# EAGLE board csa_gecko_v3.0d (EAGLE 4.16), part 1 of 2
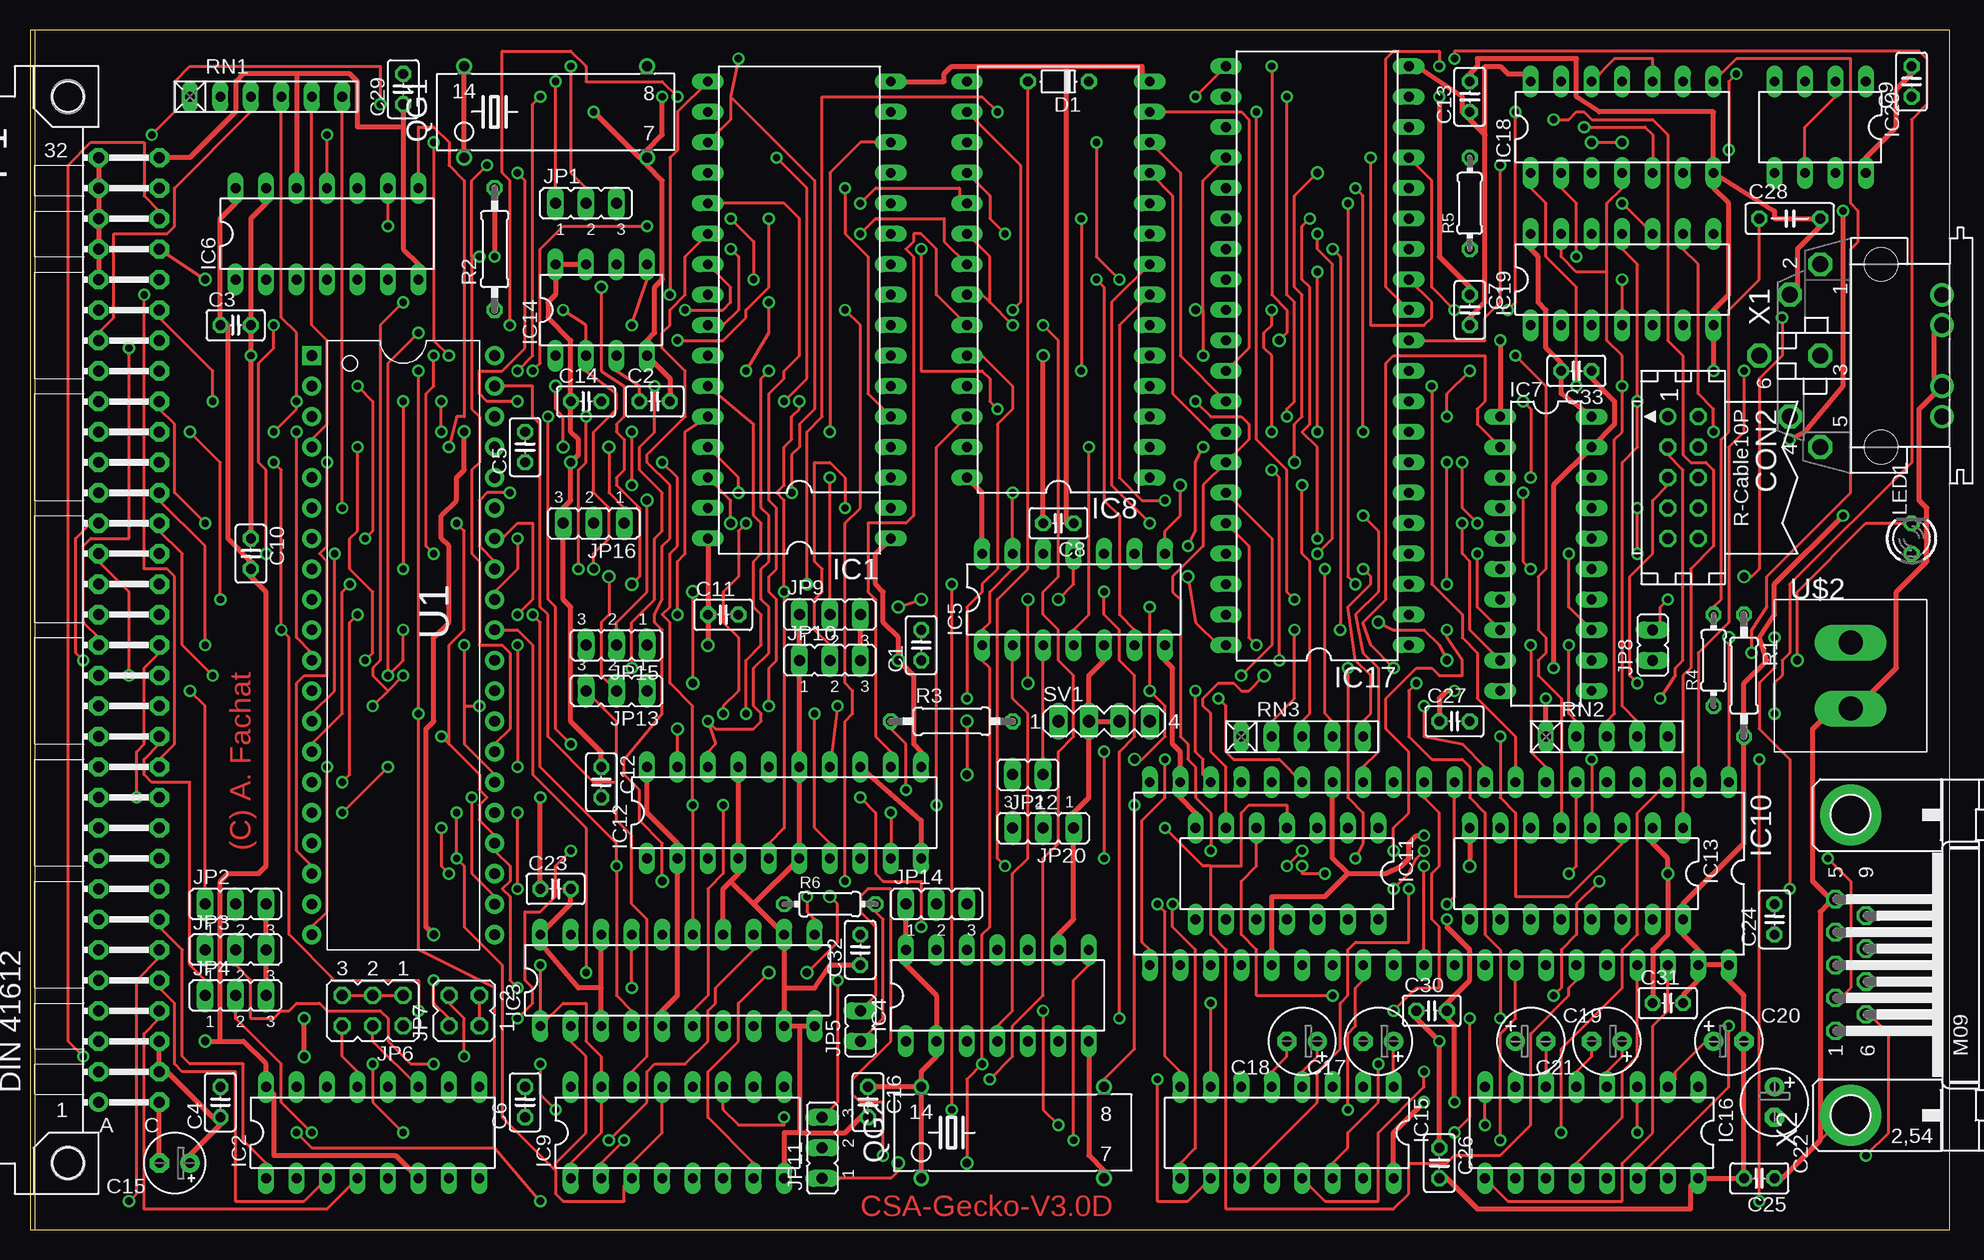
[diagram p2: board, top side]
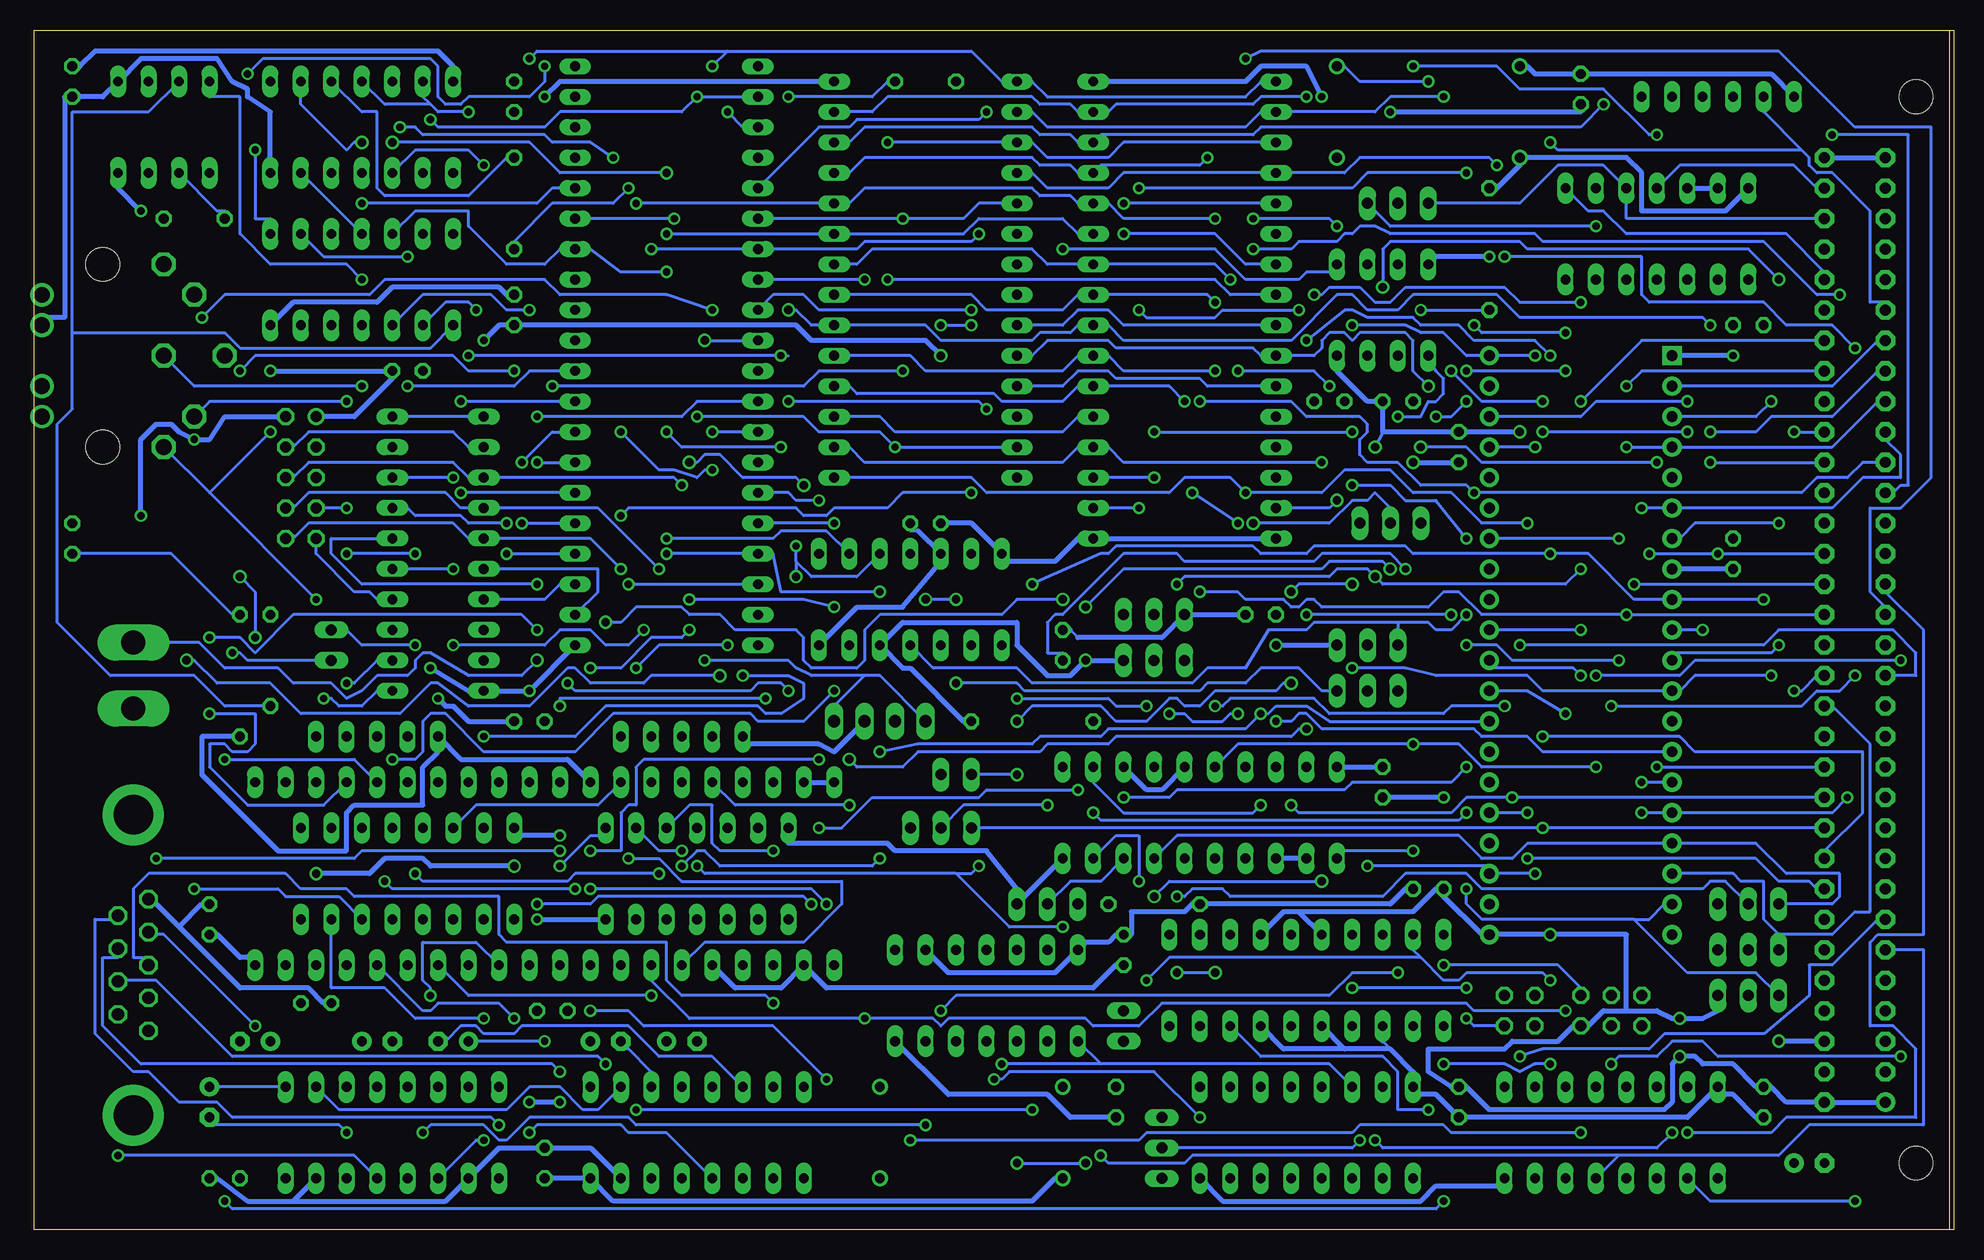
[diagram p3: board, bottom side, seen from below]

Size 160 x 100.03 mm. Coordinates in mm from the lower left corner, seen from the top.
Outline: 0,0.01 160,0.01 160,100.01 0,100.01 0,0.01
Copper layers (1*16): Top 0.035mm / dielectric 1.5mm / Bottom 0.035mm
Design rules "default": minimum track width 10mil, minimum drill 24mil, track to track 8mil, track to pad 8mil, pad to pad 8mil, via to via 8mil, smd to smd 8mil, copper to edge 40mil, drill to drill 8mil, minimum pad ring 10mil, minimum via ring 8mil, stop-mask expansion 4mil, vias tented up to drill 0mil, thermal gap 10mil

## Footprints (pad centres in the part's own frame; a part is rotated, then mirrored left to right if it is on the bottom)
C025-025X050 = drill 0.813 octagon: 1 -1.27,0; 2 1.27,0
E2,5-5 = drill 0.813 pad 1.6 round: + -1.27,0 | drill 0.813 pad 1.6 octagon: - 1.27,0
E2,5-6 = drill 0.813 pad 1.6 round: + -1.27,0 | drill 0.813 pad 1.6 octagon: - 1.27,0
C050-025X075 = drill 0.813 octagon: 1 -2.54,0; 2 2.54,0
CON10 = drill 0.914 round: 1 -5.08,-1.27 | drill 0.914 octagon: 2 -5.08,1.27; 3 -2.54,-1.27; 4 -2.54,1.27; 5 0,-1.27; 6 0,1.27; 7 2.54,-1.27; 8 2.54,1.27; 9 5.08,-1.27; 10 5.08,1.27
D-5 = drill 0.813 octagon: A 2.54,0; C -2.54,0
DIL32OPT28 = drill 0.813 long: 1 -19.05,-7.62; 2 -16.51,-7.62; 3 -13.97,-7.62; 4 -11.43,-7.62; 5 -8.89,-7.62; 6 -6.35,-7.62; 7 -3.81,-7.62; 8 -1.27,-7.62; 9 1.27,-7.62; 10 3.81,-7.62; 11 6.35,-7.62; 12 8.89,-7.62; 13 11.43,-7.62; 14 13.97,-7.62; 15 16.51,-7.62; 16 19.05,-7.62; 17 19.05,7.62; 18 16.51,7.62; 19 13.97,7.62; 20 11.43,7.62; 21 8.89,7.62; 22 6.35,7.62; 23 3.81,7.62; 24 1.27,7.62; 25 -1.27,7.62; 26 -3.81,7.62; 27 -6.35,7.62; 28 -8.89,7.62; 29 -11.43,7.62; 30 -13.97,7.62; 31 -16.51,7.62; 32 -19.05,7.62
DIL16 = drill 0.813 long: 1 -8.89,-3.81; 2 -6.35,-3.81; 3 -3.81,-3.81; 4 -1.27,-3.81; 5 1.27,-3.81; 6 3.81,-3.81; 7 6.35,-3.81; 8 8.89,-3.81; 9 8.89,3.81; 10 6.35,3.81; 11 3.81,3.81; 12 1.27,3.81; 13 -1.27,3.81; 14 -3.81,3.81; 15 -6.35,3.81; 16 -8.89,3.81
DIL20 = drill 0.813 long: 1 -10.16,-3.81; 2 -7.62,-3.81; 3 -5.08,-3.81; 4 -2.54,-3.81; 5 0,-3.81; 6 2.54,-3.81; 7 5.08,-3.81; 8 7.62,-3.81; 9 10.16,-3.81; 10 12.7,-3.81; 11 12.7,3.81; 12 10.16,3.81; 13 7.62,3.81; 14 5.08,3.81; 15 2.54,3.81; 16 0,3.81; 17 -2.54,3.81; 18 -5.08,3.81; 19 -7.62,3.81; 20 -10.16,3.81
DIL14 = drill 0.813 long: 1 -7.62,-3.81; 2 -5.08,-3.81; 3 -2.54,-3.81; 4 0,-3.81; 5 2.54,-3.81; 6 5.08,-3.81; 7 7.62,-3.81; 8 7.62,3.81; 9 5.08,3.81; 10 2.54,3.81; 11 0,3.81; 12 -2.54,3.81; 13 -5.08,3.81; 14 -7.62,3.81
DIL20' = drill 0.813 long: 1 -11.43,-3.81; 2 -8.89,-3.81; 3 -6.35,-3.81; 4 -3.81,-3.81; 5 -1.27,-3.81; 6 1.27,-3.81; 7 3.81,-3.81; 8 6.35,-3.81; 9 8.89,-3.81; 10 11.43,-3.81; 11 11.43,3.81; 12 8.89,3.81; 13 6.35,3.81; 14 3.81,3.81; 15 1.27,3.81; 16 -1.27,3.81; 17 -3.81,3.81; 18 -6.35,3.81; 19 -8.89,3.81; 20 -11.43,3.81
DIL28 = drill 0.813 long: 1 -13.97,-7.62; 2 -11.43,-7.62; 3 -8.89,-7.62; 4 -6.35,-7.62; 5 -3.81,-7.62; 6 -1.27,-7.62; 7 1.27,-7.62; 8 3.81,-7.62; 9 6.35,-7.62; 10 8.89,-7.62; 11 11.43,-7.62; 12 13.97,-7.62; 13 16.51,-7.62; 14 19.05,-7.62; 15 19.05,7.62; 16 16.51,7.62; 17 13.97,7.62; 18 11.43,7.62; 19 8.89,7.62; 20 6.35,7.62; 21 3.81,7.62; 22 1.27,7.62; 23 -1.27,7.62; 24 -3.81,7.62; 25 -6.35,7.62; 26 -8.89,7.62; 27 -11.43,7.62; 28 -13.97,7.62
DIL40 = drill 0.813 long: 1 -16.51,-7.62; 2 -13.97,-7.62; 3 -11.43,-7.62; 4 -8.89,-7.62; 5 -6.35,-7.62; 6 -3.81,-7.62; 7 -1.27,-7.62; 8 1.27,-7.62; 9 3.81,-7.62; 10 6.35,-7.62; 11 8.89,-7.62; 12 11.43,-7.62; 13 13.97,-7.62; 14 16.51,-7.62; 15 19.05,-7.62; 16 21.59,-7.62; 17 24.13,-7.62; 18 26.67,-7.62; 19 29.21,-7.62; 20 31.75,-7.62; 21 31.75,7.62; 22 29.21,7.62; 23 26.67,7.62; 24 24.13,7.62; 25 21.59,7.62; 26 19.05,7.62; 27 16.51,7.62; 28 13.97,7.62; 29 11.43,7.62; 30 8.89,7.62; 31 6.35,7.62; 32 3.81,7.62; 33 1.27,7.62; 34 -1.27,7.62; 35 -3.81,7.62; 36 -6.35,7.62; 37 -8.89,7.62; 38 -11.43,7.62; 39 -13.97,7.62; 40 -16.51,7.62
DIL08 = drill 0.813 long: 1 -11.43,-2.54; 2 -8.89,-2.54; 3 -6.35,-2.54; 4 -3.81,-2.54; 5 -3.81,5.08; 6 -6.35,5.08; 7 -8.89,5.08; 8 -11.43,5.08
DIL08' = drill 0.813 long: 1 -3.81,-3.81; 2 -1.27,-3.81; 3 1.27,-3.81; 4 3.81,-3.81; 5 3.81,3.81; 6 1.27,3.81; 7 -1.27,3.81; 8 -3.81,3.81
JP2 = drill 0.914 long: 1 -2.54,0; 2 0,0; 3 2.54,0
JP1 = drill 0.914 long: 1 0,-1.27; 2 0,1.27
JP3Q = drill 0.914 octagon: 1 -2.54,-1.27; 2 -2.54,1.27; 3 0,-1.27; 4 0,1.27; 5 2.54,-1.27; 6 2.54,1.27
JP2Q = drill 0.914 octagon: 1 -1.27,-1.27; 2 -1.27,1.27; 3 1.27,-1.27; 4 1.27,1.27
LED3MM = drill 0.813 octagon: A -1.27,0; K 1.27,0
CSABUS = drill 0.914 pad 1.6 round: A1 7.62,36.83 | drill 0.914 pad 1.6 octagon: A2 7.62,34.29; A3 7.62,31.75; A4 7.62,29.21; A5 7.62,26.67; A6 7.62,24.13; A7 7.62,21.59; A8 7.62,19.05; A9 7.62,16.51; A10 7.62,13.97; A11 7.62,11.43; A12 7.62,8.89; A13 7.62,6.35; A14 7.62,3.81; A15 7.62,1.27; A16 7.62,-1.27; A17 7.62,-3.81; A18 7.62,-6.35; A19 7.62,-8.89; A20 7.62,-11.43; A21 7.62,-13.97; A22 7.62,-16.51; A23 7.62,-19.05; A24 7.62,-21.59; A25 7.62,-24.13; A26 7.62,-26.67; A27 7.62,-29.21; A28 7.62,-31.75; A29 7.62,-34.29; A30 7.62,-36.83; A31 7.62,-39.37; A32 7.62,-41.91; C1 2.54,36.83; C2 2.54,34.29; C3 2.54,31.75; C4 2.54,29.21; C5 2.54,26.67; C6 2.54,24.13; C7 2.54,21.59; C8 2.54,19.05; C9 2.54,16.51; C10 2.54,13.97; C11 2.54,11.43; C12 2.54,8.89; C13 2.54,6.35; C14 2.54,3.81; C15 2.54,1.27; C16 2.54,-1.27; C17 2.54,-3.81; C18 2.54,-6.35; C19 2.54,-8.89; C20 2.54,-11.43; C21 2.54,-13.97; C22 2.54,-16.51; C23 2.54,-19.05; C24 2.54,-21.59; C25 2.54,-24.13; C26 2.54,-26.67; C27 2.54,-29.21; C28 2.54,-31.75; C29 2.54,-34.29; C30 2.54,-36.83; C31 2.54,-39.37; C32 2.54,-41.91 | hole 2.794: 10.16,41.91; 10.16,-46.99
SG51 = drill 0.813 round: 1 -7.62,-3.81; 7 7.62,-3.81; 8 7.62,3.81; 14 -7.62,3.81
0207/10 = drill 0.813 octagon: 1 -5.08,0; 2 5.08,0
0204/7 = drill 0.813 octagon: 1 -3.81,0; 2 3.81,0
RN-6 = drill 0.813 long: 1 -6.35,0; 2 -3.81,0; 3 -1.27,0; 4 1.27,0; 5 3.81,0; 6 6.35,0
RN-5 = drill 0.813 long: 1 -5.08,0; 2 -2.54,0; 3 0,0; 4 2.54,0; 5 5.08,0
MA04-1 = drill 1.016 long: 1 -3.81,0; 2 -1.27,0; 3 1.27,0; 4 3.81,0
DIP-40 = drill 0.889 pad 1.6 square: 1 -22.86,-7.62 | drill 0.889 pad 1.6 round: 2 -20.32,-7.62; 3 -17.78,-7.62; 4 -15.24,-7.62; 5 -12.7,-7.62; 6 -10.16,-7.62; 7 -7.62,-7.62; 8 -5.08,-7.62; 9 -2.54,-7.62; 10 0,-7.62; 11 2.54,-7.62; 12 5.08,-7.62; 13 7.62,-7.62; 14 10.16,-7.62; 15 12.7,-7.62; 16 15.24,-7.62; 17 17.78,-7.62; 18 20.32,-7.62; 19 22.86,-7.62; 20 25.4,-7.62; 21 25.4,7.62; 22 22.86,7.62; 23 20.32,7.62; 24 17.78,7.62; 25 15.24,7.62; 26 12.7,7.62; 27 10.16,7.62; 28 7.62,7.62; 29 5.08,7.62; 30 2.54,7.62; 31 0,7.62; 32 -2.54,7.62; 33 -5.08,7.62; 34 -7.62,7.62; 35 -10.16,7.62; 36 -12.7,7.62; 37 -15.24,7.62; 38 -17.78,7.62; 39 -20.32,7.62; 40 -22.86,7.62
TASTER = drill 2.007 long: 1 0,4.013; 3 0,-1.473
MAB6H = drill 1.321 octagon: 1 7.62,5.08; 2 5.08,7.62; 3 0,5.08; 4 -5.08,7.62; 5 -7.62,5.08; 6 0,10.16 | drill 1.321 round: PE -2.54,-5.08; PE@ 2.54,-5.08 | hole 2.794: 7.62,0; -7.62,0
M09HP = drill 1.016 octagon: 1 -5.486,1.27; 2 -2.743,1.27; 3 0,1.27; 4 2.743,1.27; 5 5.486,1.27; 6 -4.115,-1.27; 7 -1.372,-1.27; 8 1.372,-1.27; 9 4.115,-1.27 | drill 3.302 pad 5.08 round: G1 -12.522,0; G2 12.522,0

## Placement (x,y rotation side)
C1  100n  [C025-025X050]  74.29,48.74 90 top
C2  100n  [C025-025X050]  52.07,69.06 0 top
C3  100n  [C025-025X050]  17.14,75.41 0 top
C4  100n  [C025-025X050]  15.87,10.64 90 top
C5  100n  [C025-025X050]  41.27,65.25 90 top
C6  100n  [C025-025X050]  41.27,10.64 90 top
C7  100n  [C025-025X050]  120.01,76.68 270 top
C8  100n  [C025-025X050]  85.72,58.9 180 top
C9  100n  [C025-025X050]  156.84,95.73 90 top
C10  100n  [C025-025X050]  18.41,56.36 270 top
C11  100n  [C025-025X050]  57.78,51.28 0 top
C12  100n  [C025-025X050]  47.62,37.31 270 top
C13  100n  [C025-025X050]  120.01,94.46 90 top
C14  100n  [C025-025X050]  46.35,69.06 0 top
C15  47u  [E2,5-5]  12.06,5.56 180 top
C16  100n  [C025-025X050]  69.84,10.64 270 top
C17  1u  [E2,5-6]  112.39,15.72 180 top
C18  1u  [E2,5-6]  106.04,15.72 180 top
C19  4u7  [E2,5-6]  125.09,15.72 0 top
C20  4u7  [E2,5-6]  141.6,15.72 0 top
C21  1u  [E2,5-6]  131.44,15.72 180 top
C22  1u  [E2,5-6]  145.41,10.64 270 top
C23  100n  [C025-025X050]  43.81,28.42 0 top
C24  100n  [C025-025X050]  145.41,25.88 90 top
C25  100n  [C025-025X050]  144.14,4.29 180 top
C26  100n  [C025-025X050]  117.47,5.56 270 top
C27  100n  [C025-025X050]  118.74,42.39 0 top
C28  390p  [C050-025X075]  146.68,84.3 0 top
C29  100n  [C025-025X050]  31.11,95.1 90 top
C30  100n  [C025-025X050]  116.83,18.26 0 top
C31  100n  [C025-025X050]  136.52,18.9 0 top
C32  100n  [C025-025X050]  69.21,23.34 90 top
C33  100n  [C025-025X050]  128.9,71.6 180 top
CON2  [CON10]  137.79,62.71 270 top
D1  [D-5]  85.72,95.73 180 top
IC1  ROMSOCK32TO512K  [DIL32OPT28]  64.13,76.68 90 top
IC2  74LS138N  [DIL16]  28.57,8.1 0 top
IC3  74LS688BUSOPT  [DIL20]  52.7,20.8 0 top
IC4  74LS164N  [DIL14]  80.64,19.53 0 top
IC5  74LS86N  [DIL14]  86.99,52.55 0 top
IC6  74LS293N  [DIL14]  24.76,83.03 0 top
IC7  74LS245N  [DIL20']  126.36,56.36 270 top
IC8  RAMSOCKET8OR32K  [DIL28]  85.72,76.68 90 top
IC9  74LS139N  [DIL16]  53.97,8.1 0 top
IC10  UART  [DIL40]  125.09,29.69 180 top
IC11  74LS06N  [DIL14]  104.77,29.69 180 top
IC12  74LS688BUSOPT  [DIL20]  61.59,34.77 0 top
IC13  74LS138N  [DIL16]  128.9,29.69 180 top
IC14  TL7705  [DIL08]  55.24,75.41 0 top
IC15  MAX232  [DIL16]  104.77,8.1 180 top
IC16  MAX232  [DIL16]  130.17,8.1 180 top
IC17  VIA  [DIL40]  107.31,65.25 90 top
IC18  74LS06N  [DIL14]  132.71,91.92 0 top
IC19  74LS14N  [DIL14]  132.71,79.22 0 top
IC20  LMC555N  [DIL08']  149.22,91.92 180 top
JP1  [JP2]  46.35,85.57 0 top
JP2  [JP2]  17.14,27.15 0 top
JP3  [JP2]  17.14,23.34 0 top
JP4  [JP2]  17.14,19.53 0 top
JP5  [JP1]  69.21,16.99 0 top
JP6  [JP3Q]  28.57,18.26 180 top
JP7  [JP2Q]  36.19,18.26 90 top
JP8  [JP1]  135.25,48.74 0 top
JP9  [JP2]  66.67,51.28 0 top
JP10  [JP2]  66.67,47.47 0 top
JP11  [JP2]  66.03,6.83 90 top
JP12  [JP1]  83.18,37.95 90 top
JP13  [JP2]  48.89,44.93 180 top
JP14  [JP2]  75.56,27.15 0 top
JP15  [JP2]  48.89,48.74 180 top
JP16  [JP2]  46.98,58.9 180 top
JP20  [JP2]  84.45,33.5 180 top
LED1  [LED3MM]  156.84,57.63 90 top
P1  CSABUS  [CSABUS]  13.33,47.47 180 top
QG1  16MHz  [SG51]  43.81,93.19 0 top
QG2  1,8432MHz  [SG51]  81.91,8.1 0 top
R1  240  [0207/10]  142.87,46.2 270 top
R2  10k  [0207/10]  38.73,81.76 90 top
R3  10k  [0207/10]  76.83,42.39 0 top
R4  47k  [0204/7]  140.33,47.47 90 top
R5  33  [0204/7]  120.01,85.57 90 top
R6  33  [0204/7]  66.67,27.15 0 top
RN1  10k  [RN-6]  19.68,94.46 0 top
RN2  [RN-5]  131.44,41.12 0 top
RN3  [RN-5]  106.04,41.12 0 top
SV1  [MA04-1]  89.53,42.39 0 top
U1  [DIP-40]  31.11,50.01 270 top
U$2  TASTER  [TASTER]  151.76,44.93 0 top
X1  MAB6H  [MAB6H]  154.3,72.87 90 top
X2  [M09HP]  151.76,22.07 90 top

## Tracks (layer width: path | path; a pad name or v marks a point on that pad's centre or on a via)
2PHI2  (via drill 0.7)
  Top 0.254: P1.C29 v14.6,79.22 | v47.62,78.59 47.62,71.6 49.53,70.33 49.53,67.79 48.89,67.16 48.89,66.52 49.53,65.89 49.53,63.35 48.89,62.71 48.89,62.08 50.8,60.17 50.8,54.46 v50.16,53.82 | v78.1,42.39 v78.1,37.95 | v55.24,53.19 v55.24,45.57
  Bottom 0.254: v14.6,79.22 17.14,81.76 35.55,81.76 36.19,82.4 46.98,82.4 47.62,81.76 v47.62,78.59 | v78.1,42.39 76.83,43.66 71.11,43.66 69.84,42.39 67.3,42.39 65.4,44.3 64.77,44.3 64.13,43.66 62.86,43.66 61.59,44.93 56.51,44.93 55.88,45.57 v55.24,45.57 | v78.1,37.95 JP12.2 | v50.16,53.82 54.61,53.82 v55.24,53.19
8PHI2  (via drill 0.61)
  Top 0.254: v45.08,97 45.08,88.11 46.35,86.84 JP1.2 | IC6.11 v24.76,91.29
  Bottom 0.254: IC6.11 22.86,88.75 13.33,88.75 11.43,86.84 P1.C31 | v45.08,97 38.1,97 36.19,95.1 29.2,95.1 25.39,91.29 v24.76,91.29
16MHZ  (via drill 0.61)
  Top 0.254: JP1.1 v43.81,95.73 | v86.99,7.47 86.99,20.8 88.26,22.07 IC4.8 | v31.11,8.1 28.57,10.64 v28.57,13.82 | v4.44,14.45 3.17,15.72 3.17,88.75 5.08,90.65 9.52,90.65 9.52,86.21 10.79,84.94 P1.C30
  Bottom 0.254: v43.81,95.73 49.53,95.73 50.8,97 QG1.8 | v86.99,7.47 67.94,7.47 67.3,8.1 50.16,8.1 49.53,8.74 42.54,8.74 41.91,8.1 v31.11,8.1 | v28.57,13.82 27.93,14.45 24.76,14.45 23.49,15.72 20.95,15.72 19.68,14.45 v4.44,14.45 | P1.C30 27.3,84.3 IC6.10 29.2,88.75 33.02,88.75 36.19,85.57 JP1.1
/ATNAOUT  (via drill 0.7)
  Top 0.254: IC5.8 94.61,58.27 95.88,59.54 v95.88,62.08 | v105.41,63.98 105.41,67.16 106.04,67.79 106.04,77.95 105.41,78.59 105.41,86.21 v107.31,88.11 | v130.17,90.65 v132.71,90.65
  Bottom 0.254: v95.88,62.08 96.52,62.71 100.96,62.71 102.86,64.62 104.13,64.62 104.77,63.98 v105.41,63.98 | v107.31,88.11 116.2,88.11 118.74,90.65 v130.17,90.65 | IC18.9 137.79,93.83 133.98,90.02 133.34,90.65 v132.71,90.65
/ATNIN  (via drill 0.61, 0.7)
  Top 0.254: v96.52,57 97.15,58.27 97.15,63.98 v97.78,65.25 | v107.31,66.52 v107.31,79.86 | IC17.40 99.05,48.74 97.15,50.65 v96.52,54.46
  Bottom 0.254: IC19.12 128.27,84.94 123.82,84.94 123.82,83.67 120.64,80.49 117.47,80.49 116.2,81.76 IC17.14 113.66,81.76 111.12,79.86 v107.31,79.86 | 96.52,55.73 95.24,54.46 91.44,54.46 IC5.10 | 96.52,55.73 v96.52,57 | v107.31,66.52 106.04,65.25 v97.78,65.25 | 96.52,55.73 v96.52,54.46
/ATNOUT  (via drill 0.61)
  Top 0.254: v122.55,88.75 122.55,77.32 121.28,76.05 121.28,74.14 IC17.11
  Bottom 0.254: v122.55,88.75 123.82,90.02 128.27,90.02 IC18.3
/BSEL  (via drill 0.61)
  Top 0.254: JP6.5 JP6.3 JP6.1 | IC9.1 45.08,5.56 47.62,8.1 IC9.15 47.62,14.45 46.35,15.72 46.35,18.9 44.45,18.9 IC3.1 v42.54,22.07
  Bottom 0.254: v42.54,22.07 33.02,22.07 31.11,20.17 JP6.1
/CLKIN  (via drill 0.61)
  Top 0.254: v132.71,85.57 IC19.10
  Bottom 0.254: v132.71,85.57 118.1,85.57 116.83,86.84 IC17.16
/CLKOUT  (via drill 0.61)
  Top 0.254: v111.75,89.38 111.75,75.41 116.2,75.41 116.83,76.05 116.83,77.32 IC17.13 | v129.53,91.92 134.62,91.92 135.25,91.29 IC18.5
  Bottom 0.254: v111.75,89.38 113.66,90.65 116.83,90.65 117.47,91.29 127.63,91.29 128.27,91.92 v129.53,91.92
/DATAIN  (via drill 0.61)
  Top 0.254: v117.47,97 117.47,98.27 113.66,98.27 113.02,97.64 113.02,78.59 IC17.12 | v142.23,96.37 141.6,95.73 v141.6,90.02
  Bottom 0.254: v117.47,97 117.47,95.73 118.74,94.46 123.82,94.46 124.45,93.83 125.72,93.83 126.36,94.46 126.36,97 126.99,97.64 140.97,97.64 v142.23,96.37 | v141.6,90.02 141.6,84.3 140.33,84.3 IC19.8
/DATAOUT  (via drill 0.61)
  Top 0.254: v128.9,70.33 128.9,78.59 126.36,81.13 126.36,85.57 125.09,86.84 IC18.1
  Bottom 0.254: v128.9,70.33 120.01,70.33 118.74,71.6 IC17.10
/IOSEL  (via drill 0.61)
  Top 0.254: v36.19,14.45 36.19,17.63 34.92,18.9 JP7.4
  Bottom 0.254: v36.19,14.45 34.29,15.09 25.39,15.09 24.12,16.36 15.87,16.36 12.06,19.53 12.06,22.07 10.16,22.07 6.34,25.88 P1.A7
/IRQ  (via drill 0.61)
  Top 0.254: RN1.5 23.49,75.41 24.76,74.14 24.76,67.16 23.49,65.89 U1.4 | v104.77,30.33 v106.04,31.6 | v81.27,30.33 80.64,30.96 80.64,52.55 83.18,55.09 D1.A | v27.3,65.25 27.3,58.27 26.66,57.63 26.66,55.09 28.57,53.19 28.57,48.11 v27.93,47.47 | v40.64,48.74 v40.64,38.58 | v69.21,36.04 70.48,34.77 70.48,29.69 71.11,29.06 74.29,29.06 v74.29,25.25
  Bottom 0.254: P1.A24 6.34,69.06 10.16,65.25 U1.4 v27.3,65.25 | v106.04,31.6 107.94,31.6 IC11.2 | v104.77,30.33 104.13,29.69 83.18,29.69 | 83.18,29.69 81.91,29.69 v81.27,30.33 | v27.93,47.47 36.83,47.47 38.1,48.74 v40.64,48.74 | v40.64,38.58 41.91,37.31 50.16,37.31 50.8,36.68 64.77,36.68 65.4,36.04 v69.21,36.04 | v74.29,25.25 78.73,25.25 83.18,29.69
/ISIO  (via drill 0.61)
  Top 0.254: v45.08,31.6 43.81,30.33 43.81,27.79 42.54,26.52 41.27,26.52 41.27,20.8 41.91,20.17 41.91,18.9 v40.64,17.63 | JP7.1 JP7.3
  Bottom 0.254: v45.08,31.6 50.8,31.6 IC12.1 | v40.64,17.63 40,16.99 JP7.1
/LOCALIO  (via drill 0.61, 0.7)
  Top 0.254: v102.23,93.19 102.23,65.89 104.77,63.35 104.77,53.19 v105.41,52.55 | v93.34,51.92 v93.34,44.93 94.61,43.66 94.61,41.12 92.7,39.22 v92.07,39.22 | v130.17,39.22 IC13.4 | IC12.19 v53.97,41.76
  Bottom 0.254: v102.23,93.19 100.96,91.92 IC17.23 | v105.41,52.55 95.88,52.55 v93.34,51.92 | v93.34,44.93 95.88,42.39 99.69,42.39 100.32,43.03 111.75,43.03 114.93,39.85 122.55,39.85 125.72,43.03 126.99,43.03 127.63,42.39 127.63,39.85 128.27,39.22 v130.17,39.22 | v53.97,41.76 54.61,41.76 55.24,41.12 69.84,41.12 70.48,40.49 75.56,40.49 76.19,39.85 86.35,39.85 87.62,38.58 91.44,38.58 v92.07,39.22
/MEMSEL  (via drill 0.61)
  Top 0.254: v71.11,6.2 71.11,10.64 69.21,10.64 68.57,11.28 68.57,12.55 71.75,15.72 71.75,28.42 69.84,28.42 69.21,27.79 69.21,26.52 70.48,25.25 70.48,19.53 JP5.2
  Bottom 0.254: 27.93,6.2 14.6,6.2 12.06,8.74 2.54,8.74 2.54,23.34 P1.A6 | 27.93,6.2 IC2.5 | v71.11,6.2 70.48,5.56 64.13,5.56 63.5,6.2 27.93,6.2
/MIO  (via drill 0.61)
  Top 0.254: v33.65,20.8 33.65,18.9 34.92,17.63 JP7.2 | v67.3,20.8 67.3,10.64 JP11.3
  Bottom 0.254: 44.45,22.71 42.54,20.8 41.27,20.8 40.64,21.44 34.29,21.44 v33.65,20.8 | 44.45,22.71 45.08,23.34 IC3.19 | v67.3,20.8 65.4,22.71 44.45,22.71
/NMI  (via drill 0.61)
  Top 0.254: v26.03,60.17 RN1.6
  Bottom 0.254: v26.03,60.17 U1.6 10.16,60.17 7.62,62.71 4.44,62.71 4.44,64.62 5.71,65.89 P1.A23
/RAMSEL  (via drill 0.61)
  Top 0.254: v62.86,9.37 62.86,8.74 59.05,8.74 57.78,10.01 IC9.11 | v80,12.55 81.91,14.45 81.91,16.99 84.45,19.53 84.45,30.96 85.72,32.23 85.72,39.85 86.99,41.12 86.99,46.2 85.72,47.47 85.72,50.01 84.45,51.28 84.45,53.19 85.72,54.46 85.72,74.14 v84.45,75.41 | 80,77.32 79.37,77.95 IC8.22 | v81.91,75.41 80,77.32 | 80,77.32 80,81.13 IC8.20
  Bottom 0.254: v62.86,9.37 66.67,13.18 78.73,13.18 79.37,12.55 v80,12.55 | v84.45,75.41 v81.91,75.41
/RES  (via drill 0.61)
  Top 0.254: v98.42,31.6 98.42,34.77 97.15,36.04 97.15,38.58 96.52,39.22 96.52,40.49 95.88,41.12 95.88,52.55 95.24,53.19 95.24,54.46 97.78,57 97.78,62.08 IC17.34 101.59,65.89 101.59,67.16 100.96,67.79 98.42,67.79 v97.15,69.06 | v50.16,75.41 51.43,79.22 IC14.5 | v34.92,72.87 33.65,74.14 v33.65,90.65 | v80.64,68.43 80,69.06 80,70.97 79.37,71.6 74.29,71.6 v74.29,81.76
  Bottom 0.254: v98.42,31.6 102.86,31.6 103.5,32.23 103.5,35.41 105.41,35.41 IC11.3 | v50.16,75.41 45.72,75.41 44.45,74.78 42.54,74.78 40.64,72.87 U1.40 v34.92,72.87 | 12.7,90.02 12.06,89.38 12.06,88.75 11.43,88.11 10.16,88.11 6.98,84.94 6.98,77.32 5.71,77.32 P1.A27 | 12.7,90.02 15.87,93.19 RN1.2 | v33.65,90.65 33.02,90.02 12.7,90.02 | v97.15,69.06 81.27,69.06 v80.64,68.43 | v74.29,81.76 61.59,81.76 59.05,79.22 54.61,79.22 53.97,79.86 52.07,79.86 IC14.5
/SO  (via drill 0.61)
  Top 0.254: RN1.4 20.95,76.05 22.22,74.78 v22.22,69.06 22.22,68.43 v20.31,66.52
  Bottom 0.254: v22.22,69.06 29.84,69.06 31.11,67.79 U1.38 | v20.31,66.52 16.5,66.52 15.24,67.79 10.16,67.79 6.34,71.6 P1.A25
/UARTRD  (via drill 0.61)
  Top 0.254: v94.61,39.22 94.61,36.04 92.7,34.14 92.7,23.98 93.34,23.34 IC10.21 | v113.66,31.6 113.66,33.5 114.93,34.77 114.93,39.85 113.02,41.76 113.02,44.3 115.56,46.84 116.83,46.84 117.47,46.2 119.38,46.2 119.38,47.47 118.1,49.38 v118.1,50.01 | v145.41,49.38 145.41,46.84 144.14,45.57 144.14,41.76 146.68,39.22 v146.68,28.42
  Bottom 0.254: v94.61,39.22 109.21,39.22 109.85,38.58 109.85,35.41 110.48,35.41 111.12,34.77 111.12,31.6 v113.66,31.6 | v118.1,50.01 119.38,51.28 138.42,51.28 141.6,48.11 142.87,49.38 v145.41,49.38 | v146.68,28.42 139.69,28.42 139.06,27.79 134.62,27.79 IC13.14
/UARTWR  (via drill 0.61)
  Top 0.254: v122.55,17.63 122.55,23.34 121.28,24.61 121.28,34.77 120.01,36.04 120.01,38.58 119.38,39.22 116.83,39.22 114.93,41.12 114.93,44.93 v115.56,45.57 | v97.15,44.93 97.15,39.85 97.78,39.22 97.78,37.95 IC10.18
  Bottom 0.254: v122.55,17.63 128.27,17.63 130.81,20.17 135.25,20.17 IC13.15 | v115.56,45.57 114.93,44.93 100.32,44.93 99.69,45.57 97.78,45.57 v97.15,44.93
/VIAIRQ  (via drill 0.61)
  Top 0.254: v97.15,94.46 IC17.21
  Bottom 0.254: v97.15,94.46 90.16,94.46 88.89,95.73 D1.C
A0  (via drill 0.61)
  Top 0.254: v110.48,53.82 109.85,54.46 v109.85,85.57 | v109.85,10.01 109.85,16.36 110.48,16.99 110.48,20.17 111.12,20.8 IC10.28 | v76.83,53.82 v76.83,10.01 | v13.33,66.52 15.87,63.98 v15.87,52.55 | v61.59,84.3 61.59,78.59 59.69,76.68 59.69,76.05 57.78,74.14 v53.97,74.14 | v33.65,72.87 33.65,70.33 33.02,69.7 33.02,57 v33.65,56.36
  Bottom 0.254: v110.48,53.82 IC17.38 | v109.85,85.57 IC8.10 92.07,85.57 90.8,86.84 76.83,86.84 76.19,86.21 73.66,86.21 73.02,85.57 IC1.12 70.48,85.57 69.21,84.3 v61.59,84.3 | v76.83,10.01 v109.85,10.01 | v76.83,53.82 71.11,56.36 70.48,56.36 69.84,57 58.41,57 57.78,56.36 53.97,56.36 53.34,57 45.72,57 45.08,56.36 v33.65,56.36 30.47,56.36 26.66,52.55 U1.9 v15.87,52.55 | v13.33,66.52 P1.C23 | v53.97,74.14 50.8,76.68 50.16,76.68 48.89,76.05 45.08,76.05 44.45,75.41 41.27,75.41 40,74.14 34.92,74.14 v33.65,72.87
A1  (via drill 0.61)
  Top 0.254: v20.31,63.98 20.95,63.35 v20.95,50.01 21.58,49.38 21.58,24.61 25.39,20.8 32.38,20.8 v32.38,18.26 | v107.31,56.36 108.58,57.63 108.58,80.49 107.31,81.76 v107.31,83.03 | v90.8,17.63 90.8,39.85 92.07,41.12 92.07,46.2 90.8,47.47 90.8,50.01 89.53,51.28 v89.53,53.19
  Bottom 0.254: v20.31,63.98 P1.C22 | v20.95,50.01 U1.10 | IC1.11 73.02,83.03 74.29,84.3 81.27,84.3 82.55,83.03 IC8.9 v107.31,83.03 | v107.31,56.36 IC17.37 98.42,56.36 97.78,53.19 v89.53,53.19 | IC10.27 108.58,20.8 105.41,17.63 v90.8,17.63 85.08,17.63 84.45,16.99 83.81,17.63 72.38,17.63 71.75,16.99 67.94,16.99 66.03,18.9 40.64,18.9 40,18.26 v32.38,18.26
A2  (via drill 0.61)
  Top 0.254: v14.6,48.74 14.6,57 10.79,60.81 P1.C21 | v93.34,58.9 90.16,62.08 90.16,77.32 IC8.8 | v110.48,30.96 111.12,32.23 111.12,34.77 109.85,36.04 v109.85,46.84 | v102.23,48.74 101.59,49.38 101.59,57 IC17.36 | v22.22,66.52 22.22,49.38 23.49,48.11 U1.11 | v34.29,66.52 v34.29,69.06 | v41.91,71.6 42.54,72.24 42.54,81.76 44.45,83.67 v51.43,83.67 | v58.41,84.3 60.32,82.4 v60.32,79.22
  Bottom 0.254: v14.6,48.74 15.24,48.11 23.49,48.11 U1.11 | IC8.8 91.44,80.49 90.16,81.76 76.83,81.76 75.56,80.49 IC1.10 61.59,80.49 v60.32,79.22 | v93.34,58.9 IC17.36 | v110.48,30.96 107.94,30.96 106.04,29.06 92.7,29.06 92.7,27.15 95.88,23.98 104.13,23.98 IC10.26 | v109.85,46.84 107.94,48.74 v102.23,48.74 | v22.22,66.52 v34.29,66.52 | v34.29,69.06 39.37,69.06 v41.91,71.6 | v51.43,83.67 52.07,84.3 v58.41,84.3
A3  (via drill 0.61)
  Top 0.254: v15.24,46.2 12.7,48.74 12.7,56.36 10.79,58.27 P1.C20 | v122.55,41.12 122.55,36.04 123.82,34.77 123.82,27.79 128.27,27.79 132.71,32.23 IC13.3 | v100.96,46.2 103.5,48.74 103.5,57.63 IC17.35 | v94.61,60.81 92.7,60.81 90.8,62.71 90.8,75.41 IC8.7 | v50.16,46.84 50.16,50.65 52.07,52.55 52.07,57.63 52.7,58.27 52.7,61.44 50.8,63.35 50.8,65.25 52.07,66.52 v52.07,70.33 | v59.69,71.6 61.59,74.78 v61.59,77.32
  Bottom 0.254: v15.24,46.2 21.58,46.2 22.86,44.93 U1.12 34.29,44.93 35.55,46.2 43.18,46.2 45.72,46.84 v50.16,46.84 | IC8.7 81.91,77.95 80.64,76.68 74.29,76.68 73.02,77.95 IC1.9 62.23,77.95 v61.59,77.32 | v122.55,41.12 114.93,41.12 112.39,43.66 99.69,43.66 99.05,43.03 97.78,43.03 95.88,44.3 95.88,45.57 97.15,46.2 v100.96,46.2 | v94.61,60.81 96.52,60.81 97.15,61.44 IC17.35 | v52.07,70.33 53.34,71.6 v59.69,71.6
A4  (via drill 0.61, 0.7)
  Top 0.254: v25.39,56.36 25.39,44.93 23.49,43.03 U1.13 | v123.82,72.87 126.36,70.33 126.36,55.09 125.72,54.46 125.72,50.01 126.36,49.38 126.36,48.11 125.72,47.47 125.72,46.2 127.63,44.3 IC13.5 | 97.78,76.68 v97.78,72.87 | 97.78,76.68 97.78,87.48 IC17.24 | v19.68,56.36 19.68,63.35 19.04,63.98 19.04,72.24 20.31,73.51 v20.31,75.41 | v97.15,76.68 97.78,76.68
  Bottom 0.254: v25.39,56.36 v19.68,56.36 P1.C19 | 97.15,72.87 v97.78,72.87 v123.82,72.87 | v20.31,75.41 20.95,76.05 36.19,76.05 38.1,77.95 45.08,77.95 46.35,76.68 48.89,76.68 50.16,77.95 51.43,77.95 55.24,74.14 69.21,74.14 70.48,75.41 IC1.8 73.02,75.41 73.66,74.78 76.19,74.78 76.83,74.14 84.45,74.14 85.72,75.41 IC8.6 95.24,75.41 96.52,76.68 v97.15,76.68
A5  (via drill 0.61)
  Top 0.254: IC12.18 56.51,39.85 57.15,40.49 v56.51,42.39 57.15,41.76 60.32,41.76 60.96,42.39 60.96,43.03 60.32,43.66 60.32,46.84 61.59,48.11 61.59,51.92 60.96,52.55 60.96,55.09 61.59,55.73 61.59,59.54 60.96,60.17 60.96,70.97 v61.59,71.6 | v26.66,53.82 26.03,53.19 26.03,43.03 23.49,40.49 U1.14
  Bottom 0.254: IC8.5 86.99,72.87 85.72,71.6 74.29,71.6 73.02,72.87 IC1.7 70.48,72.87 69.21,71.6 v61.59,71.6 | v56.51,42.39 55.24,42.39 54.61,43.03 53.97,43.03 52.7,41.76 40,41.76 39.37,41.12 35.55,41.12 34.29,39.85 U1.14 | v26.66,53.82 P1.C18
A6  (via drill 0.61)
  Top 0.254: v64.13,69.06 64.13,68.43 63.5,67.79 63.5,65.89 62.86,65.25 62.86,62.08 62.23,61.44 62.86,60.81 v62.86,53.19 62.86,33.5 61.59,32.23 IC12.5 | v26.03,37.31 26.66,37.95 26.66,50.65 v27.3,51.28
  Bottom 0.254: v64.13,69.06 65.4,70.33 IC1.6 73.02,70.33 74.29,69.06 79.37,69.06 80,69.7 91.44,69.7 92.07,70.33 IC8.4 | v62.86,53.19 59.69,53.19 59.05,52.55 55.88,52.55 55.24,51.92 54.61,51.92 53.97,52.55 53.34,52.55 52.7,51.92 43.81,51.92 42.54,53.19 41.27,53.19 39.37,51.28 v27.3,51.28 P1.C17 | U1.15 v26.03,37.31
A7  (via drill 0.61)
  Top 0.254: v26.03,34.77 v29.84,38.58 | v8.89,36.04 8.89,39.85 9.52,40.49 9.52,46.84 10.79,48.11 P1.C16 | v67.94,86.84 67.94,83.03 69.84,81.13 69.84,69.7 IC1.5 | v40.64,88.11 41.27,87.48 41.27,73.51 39.37,71.6 37.46,71.6 37.46,69.7 38.1,69.06 v40.64,69.06 | v43.18,67.79 43.18,52.55 43.81,51.92 43.81,41.76 v45.08,40.49
  Bottom 0.254: IC1.5 73.02,67.79 74.29,66.52 88.26,66.52 89.53,67.79 IC8.3 | v29.84,38.58 39.37,38.58 41.27,40.49 v45.08,40.49 59.69,40.49 IC12.16 | v26.03,34.77 U1.16 10.16,34.77 v8.89,36.04 | v67.94,86.84 50.16,86.84 48.89,88.11 v40.64,88.11 | v40.64,69.06 41.91,67.79 v43.18,67.79
A8  (via drill 0.61)
  Top 0.254: v13.33,44.93 14.6,43.66 JP2.1 | v59.69,43.03 59.69,47.47 60.96,48.74 60.96,51.28 60.32,51.92 60.32,55.73 60.96,56.36 60.96,58.9 60.32,59.54 60.32,67.16 IC1.27 | v65.4,43.03 65.4,33.5 66.67,32.23 IC12.7
  Bottom 0.254: IC1.27 62.23,70.33 62.86,70.97 69.84,70.97 70.48,71.6 73.02,71.6 74.29,70.33 IC8.25 | IC12.7 64.77,32.87 41.27,32.87 39.37,30.96 36.83,30.96 35.55,32.23 U1.17 16.5,32.23 13.97,29.69 9.52,29.69 9.52,27.79 10.16,27.15 JP2.1 | v13.33,44.93 12.7,44.93 11.43,46.2 P1.C15 | v65.4,43.03 64.13,43.03 63.5,42.39 60.96,42.39 60.32,43.03 v59.69,43.03
A9  (via drill 0.61, 0.7)
  Top 0.254: v78.1,44.3 78.1,51.92 79.37,53.19 79.37,53.82 80.64,55.09 80.64,67.16 81.91,68.43 81.91,70.33 79.37,72.87 IC8.24 | v67.3,43.66 IC12.14 | v24.76,63.98 24.76,57 24.12,56.36 24.76,55.73 24.76,46.2 22.86,46.2 22.22,45.57 22.22,31.6 23.49,30.33 U1.18 | v43.81,70.33 43.81,68.43 44.45,67.79 v44.45,65.25
  Bottom 0.254: 14.6,24.61 15.87,25.88 15.87,29.06 17.77,29.06 18.41,29.69 U1.18 | 14.6,24.61 10.16,24.61 8.25,26.52 6.98,26.52 6.98,40.49 10.16,43.66 P1.C14 | 14.6,24.61 JP3.1 | IC8.24 76.83,72.87 75.56,74.14 70.48,74.14 69.84,73.51 58.41,73.51 57.78,72.87 IC1.26 53.34,72.87 52.7,73.51 52.7,74.14 52.07,74.78 50.8,74.78 50.16,74.14 49.53,74.78 45.72,74.78 45.08,74.14 45.08,71.6 v43.81,70.33 | v78.1,44.3 70.48,44.3 69.84,43.66 v67.3,43.66 | v24.76,63.98 39.37,63.98 40.64,65.25 v44.45,65.25
A10  (via drill 0.61)
  Top 0.254: v69.21,83.03 70.48,84.3 76.19,84.3 76.19,82.4 IC8.21 | v40.64,28.42 v40.64,34.77 | v71.75,34.77 IC12.9 | P1.C13 10.79,40.49 9.52,39.22 9.52,37.95 10.16,37.31 13.33,37.31 13.33,22.07 14.6,20.8 JP4.1 | v54.61,76.68 57.78,76.68 58.41,77.32 58.41,78.59 IC1.23 | v67.94,76.68 69.21,75.41 69.21,60.17 67.94,58.9 67.94,45.57 68.57,44.93 68.57,43.03 67.94,42.39 v67.94,29.06
  Bottom 0.254: v69.21,83.03 61.59,83.03 59.05,80.49 IC1.23 | v71.75,34.77 71.11,34.14 41.27,34.14 v40.64,34.77 | v40.64,28.42 40.64,27.15 39.37,25.88 26.66,25.88 | 26.66,25.88 25.39,25.88 24.12,27.15 U1.19 | 26.66,25.88 22.22,21.44 16.5,21.44 JP4.1 | v54.61,76.68 60.96,76.68 61.59,76.05 67.3,76.05 v67.94,76.68 | v67.94,29.06 67.94,32.87 69.84,32.87 IC12.9
A11  (via drill 0.61)
  Top 0.254: v24.76,38.58 24.76,26.52 23.49,25.25 U1.20 | v57.78,35.41 57.78,29.69 56.51,28.42 56.51,19.53 55.24,18.26 IC3.6 | IC8.23 75.56,77.95 75.56,81.76 74.29,83.03 73.66,83.03 73.66,82.4 73.02,81.76 73.66,81.13 73.66,59.54 73.02,58.9 69.84,58.9 69.84,53.19 70.48,52.55 70.48,41.12 71.75,39.85 IC12.12 | v9.52,77.95 9.52,55.09 11.43,55.09 12.06,54.46 12.06,40.49 10.79,39.22 P1.C12 | v58.41,81.76 59.05,81.13 59.05,76.68 57.78,75.41 IC1.25
  Bottom 0.254: v24.76,38.58 P1.C12 | IC1.25 69.21,75.41 70.48,76.68 73.02,76.68 74.29,75.41 IC8.23 | v57.78,35.41 58.41,34.77 69.21,34.77 71.75,37.31 IC12.12 | v9.52,77.95 11.43,77.95 15.87,82.4 34.29,82.4 34.92,83.03 46.98,83.03 48.26,83.67 49.53,83.67 50.16,83.03 50.8,83.03 51.43,82.4 54.61,82.4 55.24,81.76 v58.41,81.76
A12  (via drill 0.61)
  Top 0.254: IC3.15 v55.24,35.41 55.24,43.66 53.34,45.57 53.34,50.65 52.7,51.28 53.34,51.92 53.34,56.36 53.97,57 53.97,62.71 v52.7,63.98 | v36.83,36.04 36.83,29.69 38.73,27.79 U1.22
  Bottom 0.254: IC8.2 92.07,65.25 90.8,63.98 74.29,63.98 73.02,65.25 IC1.4 70.48,65.25 69.21,63.98 v52.7,63.98 | v55.24,35.41 54.61,34.77 41.91,34.77 40.64,36.04 v36.83,36.04 P1.C11
A13  (via drill 0.61)
  Top 0.254: IC3.4 50.16,18.26 48.89,19.53 v48.89,30.33 48.89,32.23 42.54,38.58 42.54,50.65 v41.91,51.28 | v53.97,51.28 53.97,55.73 54.61,56.36 54.61,66.52 IC1.28 | v34.92,29.69 34.29,30.33 v34.29,33.5
  Bottom 0.254: v48.89,30.33 38.73,30.33 U1.23 v34.92,29.69 | v41.91,51.28 v53.97,51.28 | JP20.3 v34.29,33.5 P1.C10
A14  (via drill 0.61)
  Top 0.254: v59.05,61.44 59.05,62.71 IC1.29 | v40.64,20.17 40,20.8 40,27.79 39.37,28.42 40,29.06 40,30.33 38.73,31.6 U1.24 38.73,32.87 37.46,34.14 37.46,35.41 38.1,36.04 37.46,36.68 37.46,37.95 34.92,40.49 | v50.16,20.17 IC3.17 | v34.29,41.12 34.92,40.49 | 34.92,40.49 34.92,48.74 36.19,50.01 36.19,58.27 v35.55,58.9
  Bottom 0.254: IC8.1 81.91,62.71 80.64,61.44 65.4,61.44 64.13,62.71 60.32,62.71 v59.05,61.44 52.7,61.44 50.8,63.35 46.98,63.35 45.08,61.44 41.91,61.44 39.37,58.9 v35.55,58.9 | v40.64,20.17 v50.16,20.17 | v34.29,41.12 22.86,41.12 21.58,39.85 7.62,39.85 7.62,34.77 10.79,31.6 P1.C9
A15  (via drill 0.61)
  Top 0.254: IC9.13 52.7,8.1 50.16,5.56 IC9.3 49.53,3.66 49.53,2.39 44.45,2.39 43.81,3.02 43.81,4.93 | 43.81,4.93 43.81,5.56 46.35,8.1 46.35,14.45 45.08,15.72 IC3.2 | 43.81,4.93 39.37,9.37 39.37,22.07 36.19,25.25 36.19,30.33 v35.55,30.96 v35.55,34.77
  Bottom 0.254: v35.55,30.96 16.5,30.96 14.6,29.06 12.06,29.06 11.43,28.42 P1.C8 | v35.55,34.77 U1.25
A16
  Top 0.254: IC2.1 19.68,5.56 17.77,7.47 17.77,13.82 13.33,13.82 12.7,14.45 12.7,23.34 10.79,25.25 P1.C7
A17  (via drill 0.61)
  Top 0.254: v8.25,2.39 8.89,3.02 8.89,20.8 10.79,22.71 P1.C6
  Bottom 0.254: v8.25,2.39 20.31,2.39 IC2.2
A18
  Top 0.254: IC2.3 22.86,2.39 17.14,2.39 17.14,13.18 12.7,13.18 12.06,13.82 12.06,18.9 10.79,20.17 P1.C5
A19
  Top 0.254: IC2.4 24.76,1.75 9.52,1.75 9.52,16.36 10.79,17.63 P1.C4
ATN  (via drill 0.61)
  Top 0.254: 131.44,79.86 128.9,79.86 127.63,81.13 IC19.13 | 131.44,79.86 131.44,85.57 132.71,86.84 IC18.4 | 131.44,79.86 131.44,74.14 132.71,72.87 v132.71,70.33 132.71,66.52 132.07,65.89 132.07,43.03 131.44,42.39 RN2.3
  Bottom 0.254: v132.71,70.33 146.68,70.33 X1.3
ATNA  (via drill 0.61)
  Top 0.254: v107.31,57.63 107.31,65.25 106.04,66.52 106.67,67.16 106.67,78.59 106.04,79.22 106.04,83.67 v106.67,84.3
  Bottom 0.254: v107.31,57.63 98.42,57.63 97.78,58.27 93.97,58.27 IC5.9 | v106.67,84.3 IC17.15
BPHI2  (via drill 0.61, 0.7)
  Top 0.254: v80.64,93.19 79.37,94.46 66.03,94.46 66.03,67.79 64.77,66.52 v64.77,53.82 | v31.11,69.06 v31.11,55.09 | v48.26,54.46 48.26,51.28 47.62,50.65 47.62,46.2 JP13.2
  Bottom 0.254: v80.64,93.19 81.27,92.56 91.44,92.56 92.07,91.92 94.61,91.92 IC17.25 | v64.77,53.82 64.13,54.46 52.07,54.46 51.43,55.09 48.89,55.09 v48.26,54.46 47.62,53.82 32.38,53.82 v31.11,55.09 | v31.11,69.06 26.03,74.14 P1.C26
CLK  (via drill 0.61)
  Top 0.254: RN2.4 133.98,42.39 132.71,43.66 132.71,63.98 133.98,65.25 v133.98,69.06 133.98,80.49 132.71,81.76 IC19.11
  Bottom 0.254: IC19.11 IC18.6 | v133.98,69.06 145.41,69.06 X1.4
CTS  (via drill 0.61)
  Top 0.254: v116.2,13.18 116.2,11.91 112.39,8.1 112.39,2.39 107.94,2.39 IC15.13
  Bottom 0.254: v116.2,13.18 116.83,13.82 151.12,13.82 154.3,16.99 154.3,22.71 153.03,22.71 X2.8
D0  (via drill 0.61, 0.7)
  Top 0.254: v40,61.44 38.1,61.44 37.46,60.81 37.46,57 38.73,55.73 U1.33 | v146.04,76.05 146.04,72.87 144.14,70.97 144.14,55.09 143.5,54.46 v142.87,54.46 | v103.5,66.52 103.5,72.87 102.86,73.51 102.86,74.78 103.5,75.41 v103.5,76.68 | IC8.11 95.24,86.21 95.24,69.7 98.42,66.52 IC17.33 | v62.86,69.06 64.77,70.97 64.77,86.84 v62.23,89.38 | v141.6,49.38 IC10.1
  Bottom 0.254: P1.A22 7.62,63.98 8.89,62.71 11.43,62.71 12.7,61.44 v40,61.44 40.64,62.08 44.45,62.08 46.35,63.98 48.89,63.98 49.53,64.62 49.53,65.89 48.89,66.52 48.89,67.16 49.53,67.79 50.16,67.79 53.97,67.79 55.24,69.06 v62.86,69.06 | IC8.11 92.07,88.11 90.8,89.38 76.83,89.38 76.19,88.75 73.66,88.75 73.02,88.11 IC1.13 71.11,88.75 62.86,88.75 v62.23,89.38 | v146.04,76.05 144.14,77.95 132.07,77.95 130.81,79.22 117.47,79.22 116.2,77.95 107.31,77.95 v103.5,76.68 | IC17.33 v103.5,66.52 | v141.6,49.38 141.6,53.19 v142.87,54.46
D1  (via drill 0.61)
  Top 0.254: IC17.32 95.88,72.87 95.88,88.11 IC8.12 | v142.87,71.6 142.87,66.52 141.6,65.25 141.6,50.65 139.06,48.11 IC10.2 | v120.01,71.6 118.1,69.7 v118.1,67.79 | v40.64,57.63 40.64,55.09 38.73,53.19 U1.32 | v50.16,66.52 v50.16,62.08 | v66.67,66.52 66.67,88.11 69.21,90.65 IC1.14 | v10.16,91.29 12.06,93.19 12.06,95.73 13.33,97 29.2,97 v29.2,93.83
  Bottom 0.254: IC8.12 92.07,90.65 90.8,91.92 76.83,91.92 76.19,91.29 73.66,91.29 73.02,90.65 IC1.14 71.11,91.29 58.41,91.29 57.78,91.92 31.11,91.92 v29.2,93.83 | v142.87,71.6 141.6,72.87 125.09,72.87 123.82,71.6 v120.01,71.6 | v118.1,67.79 106.04,67.79 104.77,69.06 IC17.32 | v40.64,57.63 43.18,60.81 45.72,60.81 46.98,62.08 v50.16,62.08 | v66.67,66.52 v50.16,66.52 | v10.16,91.29 3.8,91.29 3.8,62.08 4.44,62.08 5.08,61.44 P1.A21
D2  (via drill 0.61)
  Top 0.254: IC17.31 101.59,73.51 101.59,92.56 100.96,93.19 IC8.13 | v127.63,8.1 127.63,15.09 132.71,20.17 132.71,23.34 133.98,24.61 133.98,34.77 IC10.3 | v85.72,8.74 84.45,10.01 v84.45,18.26 | v46.35,21.44 46.35,33.5 41.91,37.95 41.91,48.74 40.64,50.01 U1.31 | v4.44,47.47 3.8,48.11 3.8,57.63 5.08,58.9 P1.A20 | v31.11,50.01 31.11,47.47 v29.84,46.2 29.84,72.24 v32.38,74.78 | v53.97,94.46 52.7,95.73 46.35,95.73 46.35,97 45.08,98.27 39.37,98.27 39.37,88.11 40,87.48 v40,75.41
  Bottom 0.254: IC8.13 90.16,93.19 88.89,94.46 76.83,94.46 76.19,93.83 73.66,93.83 73.02,93.19 IC1.15 70.48,93.19 69.84,93.83 58.41,93.83 57.78,94.46 v53.97,94.46 | v127.63,8.1 126.99,8.74 122.55,8.74 121.28,7.47 120.64,7.47 118.74,9.37 110.48,9.37 109.85,8.74 v85.72,8.74 | v84.45,18.26 83.18,19.53 52.07,19.53 50.16,21.44 v46.35,21.44 | v4.44,47.47 21.58,47.47 22.86,46.2 v29.84,46.2 | v31.11,50.01 U1.31 | v40,75.41 39.37,74.78 v32.38,74.78
D3  (via drill 0.61, 0.7)
  Top 0.254: v8.25,46.2 8.25,53.19 5.71,55.73 P1.A19 | 29.84,44.93 v31.11,46.2 | 29.84,44.93 v28.57,43.66 | v103.5,97 103.5,77.95 104.77,76.68 104.77,74.78 v104.13,74.14 | v145.41,43.03 145.41,45.57 146.04,46.2 146.04,47.47 146.68,48.11 146.68,53.82 156.84,63.98 156.84,92.56 158.11,93.83 158.11,97.64 157.47,98.27 118.74,98.27 v118.74,97.64 | 29.84,44.93 28.57,46.2 28.57,46.84 29.2,47.47 29.2,75.41 v31.11,77.32 | v53.34,77.95 53.34,89.38 53.97,90.02 53.97,93.19 IC1.17
  Bottom 0.254: v8.25,46.2 9.52,44.93 11.43,44.93 12.7,43.66 v28.57,43.66 | v31.11,46.2 31.74,46.84 38.73,46.84 U1.30 | IC1.17 57.78,95.73 59.05,94.46 75.56,94.46 76.83,95.73 IC8.15 79.37,95.73 81.91,98.27 102.23,98.27 | 102.23,98.27 v103.5,97 | v145.41,43.03 141.6,43.03 141.6,40.49 142.23,39.85 143.5,39.85 144.14,40.49 145.41,40.49 145.41,38.58 142.23,35.41 135.88,35.41 IC10.4 | v118.74,97.64 118.1,98.27 102.23,98.27 | v31.11,77.32 36.19,77.32 37.46,78.59 45.72,78.59 46.98,77.32 48.26,77.32 49.53,78.59 52.07,78.59 52.7,77.95 v53.34,77.95 | v104.13,74.14 IC17.30
D4  (via drill 0.61)
  Top 0.254: v81.91,76.68 82.55,77.32 82.55,88.75 IC8.16 | v144.14,2.39 v144.14,39.22 | 38.73,6.83 v42.54,2.39 | 38.73,6.83 38.73,20.17 32.38,23.34 v32.38,43.03 v32.38,71.6 | v22.22,8.1 23.49,6.83 38.73,6.83 | v42.54,94.46 41.91,93.83 41.91,72.87 v40.64,71.6
  Bottom 0.254: IC8.16 76.83,93.19 75.56,91.92 59.05,91.92 57.78,93.19 IC1.18 48.26,93.19 46.98,94.46 v42.54,94.46 | v81.91,76.68 94.61,76.68 95.88,77.95 98.42,77.95 IC17.29 | v144.14,39.22 133.34,39.22 IC10.5 | v144.14,2.39 143.5,1.75 43.18,1.75 v42.54,2.39 | v32.38,43.03 35.55,44.93 U1.29 | v22.22,8.1 15.24,8.1 13.97,9.37 3.17,9.37 3.17,15.09 5.08,16.99 6.98,16.99 6.98,23.98 6.34,24.61 2.54,24.61 2.54,50.01 5.71,53.19 P1.A18 | v32.38,71.6 v40.64,71.6
D5  (via drill 0.61)
  Top 0.254: v107.94,29.69 106.04,29.69 v106.04,30.33 | v89.53,39.85 v89.53,30.96 | v128.27,29.69 128.9,30.33 IC10.6 | v90.8,79.22 88.89,81.13 v88.89,90.65 | 58.41,94.46 58.41,92.56 IC1.19 | v59.05,97.64 58.41,94.46 | v57.78,43.03 57.78,43.66 59.05,44.93 59.05,49.38 57.78,50.65 57.78,53.19 59.05,54.46 59.05,58.27 v59.69,58.9 | v63.5,61.44 63.5,64.62 64.13,65.25 64.13,67.16 65.4,68.43 65.4,87.48 58.41,94.46
  Bottom 0.254: v128.27,29.69 127.63,29.06 115.56,29.06 114.93,29.69 v107.94,29.69 | v106.04,30.33 104.77,31.6 104.13,31.6 102.86,30.33 90.16,30.33 v89.53,30.96 | v89.53,39.85 86.35,40.49 76.83,40.49 76.19,41.12 71.11,41.12 70.48,41.76 59.05,41.76 v57.78,43.03 57.15,43.03 56.51,43.66 53.97,43.66 52.07,42.39 U1.28 | IC1.19 69.21,90.65 70.48,89.38 75.56,89.38 76.83,90.65 IC8.17 v88.89,90.65 | v90.8,79.22 IC17.28 | v59.05,97.64 57.78,98.27 14.6,98.27 8.25,91.92 1.9,91.92 1.9,62.71 4.44,60.17 6.98,60.17 6.98,53.19 5.71,51.92 P1.A17 | v63.5,61.44 v59.69,58.9
D6  (via drill 0.61)
  Top 0.254: v81.27,83.03 80,84.3 80,86.21 IC8.18 | v125.09,48.74 125.09,39.85 126.36,38.58 IC10.7 | v109.21,50.01 109.21,81.13 v108.58,81.76 | 36.83,81.13 36.83,87.48 v38.1,88.75 | 36.83,81.13 36.83,68.43 37.46,67.79 37.46,63.98 36.83,63.35 36.83,56.36 37.46,55.73 37.46,48.74 39.37,48.74 40,48.11 40,41.76 38.73,40.49 U1.27 | v8.25,73.51 8.25,57.63 5.08,57.63 4.44,57 4.44,50.65 5.71,49.38 P1.A16 | v37.46,81.13 36.83,81.13
  Bottom 0.254: IC8.18 76.83,88.11 75.56,86.84 70.48,86.84 69.21,88.11 IC1.20 50.8,88.11 49.53,89.38 38.73,89.38 v38.1,88.75 | v81.27,83.03 81.91,82.4 90.8,82.4 91.44,81.76 IC17.27 v108.58,81.76 | v125.09,48.74 117.47,48.74 116.2,50.01 113.66,50.01 112.39,48.74 110.48,48.74 v109.21,50.01 | v8.25,73.51 10.16,75.41 13.97,75.41 15.87,77.32 25.39,77.32 26.03,77.95 26.03,81.13 v37.46,81.13
D7  (via drill 0.61)
  Top 0.254: v36.19,48.74 36.19,43.66 | 36.19,43.66 36.19,40.49 38.73,37.95 U1.26 | v69.21,85.57 70.48,86.84 77.46,86.84 77.46,86.21 IC8.19 | v116.83,70.33 116.83,53.82 119.38,51.28 119.38,49.38 120.64,48.11 120.64,44.3 123.82,41.12 IC10.8 | v87.62,84.3 v87.62,71.6 | 36.19,43.66 v37.46,43.66 | v61.59,43.66 61.59,46.84 62.23,47.47 62.23,52.55 61.59,53.19 61.59,54.46 62.23,55.09 62.23,60.17 61.59,60.81 61.59,69.7 62.86,70.97 62.86,71.6 64.13,72.87 64.13,84.3 62.86,85.57 IC1.21
  Bottom 0.254: v36.19,48.74 15.87,48.74 14.6,50.01 5.08,50.01 3.17,48.11 3.17,46.2 P1.A15 | IC1.21 v69.21,85.57 | IC17.26 v87.62,84.3 82.55,84.3 81.27,85.57 IC8.19 | v116.83,70.33 95.88,70.33 94.61,71.6 v87.62,71.6 | v37.46,43.66 41.91,43.66 42.54,43.03 52.07,43.03 53.34,44.3 60.32,44.3 60.96,43.66 v61.59,43.66
DATA  (via drill 0.61)
  Top 0.254: v128.9,81.13 128.9,85.57 127.63,86.84 IC18.2 | v128.27,48.74 128.27,43.03 128.9,42.39 RN2.2 | v136.52,52.55 135.88,51.92 135.88,50.65 JP8.2 | v140.33,66.52 140.33,68.43 139.06,69.7 139.06,80.49 137.79,81.76 IC19.9
  Bottom 0.254: v128.9,81.13 135.88,81.13 IC19.9 | v128.27,48.74 132.71,48.74 133.98,50.01 JP8.2 | v136.52,52.55 145.41,61.44 | 145.41,61.44 X1.5 | 145.41,61.44 v140.33,66.52
DCD  (via drill 0.61)
  Top 0.254: v121.28,8.74 IC16.8
  Bottom 0.254: v121.28,8.74 121.91,9.37 143.5,9.37 144.78,10.64 147.95,10.64 150.49,13.18 151.76,13.18 154.94,16.36 154.94,25.88 153.66,25.88 X2.9
DSR  (via drill 0.61)
  Top 0.254: v153.03,6.2 154.94,8.1 154.94,16.36 153.66,17.63 X2.6
  Bottom 0.254: v153.03,6.2 133.34,6.2 IC16.13
DTR  (via drill 0.61)
  Top 0.254: v141.6,16.99 141.6,11.91 IC16.14
  Bottom 0.254: v141.6,16.99 149.22,24.61 149.85,24.61 X2.4
GND  (via drill 0.61, 0.7)
  Top 0.254: 149.85,27.79 X2.5 149.85,27.15 | 115.56,17.63 C30.1 | 149.22,7.47 149.85,8.1 | 158.75,74.78 X1.PE@ | C28.2 149.22,83.67 | 51.43,88.75 QG1.7 | v48.26,65.25 48.26,61.44 49.53,60.17 JP16.1
  Top 0.406: IC4.7 88.26,6.2 89.53,4.93 QG2.7 | 64.13,8.1 62.86,8.1 IC9.8 | 64.13,8.1 67.94,8.1 69.21,9.37 C16.2 | IC12.13 74.29,34.14 IC12.10 | JP9.1 JP10.1 IC12.15 IC12.6 60.32,27.15 | C15.- P1.C1 | 109.85,29.69 108.58,30.96 IC10.14 | 109.85,29.69 107.94,27.79 103.5,27.79 IC10.25 | v116.2,32.87 115.56,32.87 114.93,32.23 114.93,30.96 114.3,30.33 113.02,29.69 109.85,29.69 | JP2.3 JP3.3 JP4.3 | C23.1 v42.54,36.04 | 64.13,16.99 IC3.9 62.86,20.17 | 64.13,16.99 IC3.10 | 62.86,20.17 IC3.12 60.32,27.15 | 62.86,20.17 65.4,20.17 66.67,22.07 C32.1 | 58.41,29.06 57.78,28.42 IC3.14 | 58.41,29.06 59.05,29.69 IC12.4 IC12.17 | 58.41,29.06 60.32,27.15 | 64.13,16.99 64.13,8.1 | IC13.2 135.25,32.23 136.52,30.96 v136.52,29.69 136.52,24.61 135.25,23.34 C31.1 | 149.85,27.79 148.59,29.06 148.59,41.76 149.22,42.39 U$2.3 153.66,44.93 155.57,46.84 155.57,53.19 158.11,55.73 158.11,60.17 157.47,60.81 157.47,68.43 X1.PE 158.75,70.97 158.75,74.78 | 115.56,17.63 v117.47,15.72 C26.1 | C25.1 146.04,4.29 149.22,7.47 149.22,26.52 149.85,27.15 | 149.85,8.1 X2.G1 | v118.74,44.93 118.1,44.93 117.47,44.3 C27.1 | C33.1 130.17,70.97 132.07,69.06 132.07,67.16 IC7.19 126.99,62.08 v126.99,46.84 | 149.22,83.67 147.31,81.76 147.31,78.59 X1.2 | IC18.7 140.33,86.84 141.6,85.57 141.6,77.95 140.33,76.68 IC19.7 v140.33,71.6 | IC18.7 140.33,93.19 130.81,93.19 128.9,94.46 128.9,97.64 120.64,97.64 120.64,97 120.01,96.37 C13.2 | IC18.7 145.41,84.94 145.41,84.3 C28.2 | C2.2 53.34,70.97 IC14.4 51.43,74.14 52.07,74.78 52.07,78.59 52.7,79.22 52.7,87.48 51.43,88.75 | P1.A28 P1.A29 P1.A30 P1.A31 P1.A32 | 31.11,91.92 31.11,81.76 32.38,80.49 IC6.7
  Top 0.406: C29.1 31.11,91.92 | C10.1 v18.41,72.87 C3.2 18.41,84.3 19.68,85.57 IC6.13 | 31.11,91.92 27.3,91.92 27.3,95.73 26.66,96.37 22.22,96.37 | 22.22,96.37 IC6.12 | 22.22,96.37 17.77,96.37 17.14,95.73 17.14,93.19 13.33,89.38 P1.C32 | v46.98,93.19 50.8,89.38 QG1.7 51.43,90.02 52.7,91.29 v52.7,94.46 | 86.35,97 92.7,97 92.7,96.37 IC8.14 | 86.35,97 76.83,97 76.19,96.37 76.19,95.73 IC1.16 | IC11.7 97.15,34.77 95.88,36.04 IC10.19 95.88,39.85 95.24,40.49 95.24,46.84 94.61,47.47 IC5.7 | 86.35,97 86.35,58.9 C8.1 | v117.47,94.46 117.47,81.13 120.01,78.59 C7.1 | v36.19,66.52 36.19,63.35 35.55,62.71 35.55,60.81 34.29,59.54 34.29,57.63 34.92,57 34.92,50.65 33.65,49.38 33.65,42.39 33.02,41.76 33.02,25.25 v33.65,24.61 | IC13.8 v120.01,30.33 | v22.86,14.45 v22.86,17.63
  Bottom 0.254: 73.02,49.38 73.66,50.01 | 15.24,11.91 C4.2 16.5,11.91 | JP6.2 30.47,16.99 | 42.54,27.79 C23.1 | C6.2 41.91,11.91 | C31.1 135.88,18.9 | v117.47,15.72 C19.+ | C9.1 157.47,94.46 | C7.1 120.64,77.95 | 86.35,58.27 86.99,58.27 C8.1 | 47.62,66.52 v48.26,65.25
  Bottom 0.406: IC2.8 38.1,3.66 43.18,3.66 44.45,2.39 60.96,2.39 IC9.8 | IC4.7 83.81,11.28 75.56,11.28 73.66,9.37 C16.2 | IC12.10 JP14.3 78.1,28.42 80.64,31.6 88.26,31.6 88.89,32.23 97.15,32.23 IC11.7 | C11.2 JP9.1 66.03,49.38 73.02,49.38 | 73.66,50.01 C1.2 | IC12.13 67.3,36.68 66.03,36.68 IC12.15 | 15.24,11.91 13.97,10.64 P1.C1 P1.A1 | 16.5,11.91 18.41,13.82 20.95,13.82 21.58,14.45 v22.86,14.45 23.49,13.82 23.49,10.64 24.12,10.01 38.73,10.01 40.64,11.91 C6.2 | IC10.25 101.59,20.17 97.78,20.17 IC10.22 93.97,20.17 71.75,20.17 69.84,22.07 C32.1 | v116.2,32.87 119.38,32.87 IC13.8 | 30.47,16.99 29.2,18.26 27.3,18.26 | 27.3,18.26 24.76,18.26 23.49,17.63 20.95,17.63 19.68,18.26 JP4.3 | 42.54,27.79 39.37,24.61 U1.21 v33.65,24.61 27.3,24.61 27.3,18.26 | v42.54,36.04 C12.2 | 54.61,26.52 55.88,26.52 IC3.14 | 54.61,26.52 IC3.16 | 54.61,26.52 45.08,26.52 43.18,28.42 C23.1 | 41.91,11.91 43.81,13.18 43.81,15.09 37.46,15.09 36.83,15.72 33.02,15.72 31.74,16.99 JP6.2 | 135.88,18.9 137.16,20.17 142.87,20.17 147.95,25.25 | 147.95,25.25 149.85,27.15 X2.5 | 147.95,25.25 146.04,27.15 C24.2 | IC15.15 113.66,6.83 C26.1 121.28,6.83 IC16.10 125.72,2.39 138.42,2.39 | 138.42,2.39 142.23,2.39 144.78,4.29 C25.1 | 138.42,2.39 IC16.15 | C9.1 154.3,94.46 IC20.1 151.12,97.64 144.78,97.64 143.5,95.73 142.23,95.1 142.23,94.46 140.33,93.19 IC18.7 | 157.47,94.46 157.47,76.05 158.75,76.05 X1.PE@ | IC17.1 v118.74,44.93 IC7.10 123.82,44.93 v126.99,46.84 | CON2.1 133.34,67.79 130.17,70.97 C33.1 v140.33,71.6 | 120.64,77.95 121.28,78.59 130.17,78.59 131.44,77.32 138.42,77.32 IC19.7 | IC14.4 51.43,71.6 48.89,69.06 C14.2 47.62,66.52 C5.2 v36.19,66.52
  Bottom 0.406: P1.C32 P1.A32 | IC6.12 IC6.13 | v18.41,72.87 U1.1 | v46.98,93.19 31.11,93.19 C29.1 | 86.35,58.27 IC5.12 84.45,55.73 87.62,51.92 91.44,51.92 IC5.7 | IC10.19 IC10.20 | v52.7,94.46 53.97,97 57.78,97 59.05,95.73 IC1.16 | v117.47,94.46 116.2,95.73 IC8.14 | v120.01,30.33 126.99,30.33 127.63,30.96 130.81,30.96 132.07,29.69 v136.52,29.69
LCTS  (via drill 0.61)
  Top 0.254: v118.74,8.1 120.01,9.37 v120.01,17.63
  Bottom 0.254: v118.74,8.1 118.1,8.74 111.12,8.74 110.48,8.1 107.31,8.1 IC15.12 | v120.01,17.63 121.28,18.9 126.36,18.9 126.99,18.26 127.63,18.26 IC10.36
LDCD
  Top 0.254: IC16.9 123.19,2.39 132.71,2.39 132.71,5.56 135.25,8.1 135.25,16.99 136.52,18.26 IC10.38
LDSR
  Top 0.254: IC16.12 128.9,5.56 132.71,9.37 132.71,13.18 133.98,14.45 IC10.37
LDTR  (via drill 0.61)
  Top 0.254: v122.55,7.47 122.55,16.36 123.82,17.63 IC10.33
  Bottom 0.254: v122.55,7.47 123.19,7.47 IC16.11
LRTS  (via drill 0.61)
  Top 0.254: v114.93,28.42 114.93,23.98 110.48,23.98 109.85,23.34 109.85,19.53 109.21,18.9 109.21,15.09 107.31,13.18 107.31,10.64 IC15.11 | v130.81,29.06 128.9,27.15 128.9,24.61 127.63,23.34 127.63,20.17 v126.99,19.53
  Bottom 0.254: v114.93,28.42 130.17,28.42 v130.81,29.06 | v126.99,19.53 126.99,20.17 127.63,20.8 127.63,23.98 123.19,23.98 IC10.32
LRX  (via drill 0.61)
  Top 0.254: v95.24,27.15 95.24,25.25 97.15,23.34 97.15,6.83 95.88,5.56 IC15.9 | v118.1,27.15 118.74,27.79 IC10.10
  Bottom 0.254: v95.24,27.15 95.88,27.79 113.02,27.79 113.66,27.15 v118.1,27.15
LTX  (via drill 0.61)
  Top 0.254: v93.97,12.55 93.97,2.39 96.52,2.39 IC15.10 | v113.66,18.26 115.56,20.17 117.47,20.17 117.47,25.25 116.83,25.88 116.83,29.69 117.47,30.33 117.47,34.77 116.2,36.04 IC10.11
  Bottom 0.254: v93.97,12.55 98.42,16.99 109.21,16.99 110.48,18.26 v113.66,18.26
N$1  (via drill 0.61)
  Top 0.254: v29.84,83.67 IC6.9
  Bottom 0.254: v29.84,83.67 46.98,83.67 JP1.3
N$2
  Top 0.254: C2.1 50.8,70.33 48.89,71.6 IC14.3
N$3  (via drill 0.61)
  Top 0.254: v45.72,55.09 45.72,63.35 46.35,63.98 v46.35,67.79
  Bottom 0.254: v45.72,55.09 46.98,56.36 52.7,56.36 53.34,55.73 64.13,55.73 64.77,56.36 69.21,56.36 74.29,51.28 74.92,51.28 75.56,50.65 75.56,48.11 74.29,48.11 C1.1 | v46.35,67.79 44.45,67.79 43.81,69.06 43.18,69.06 42.54,69.7 42.54,70.97 43.18,71.6 IC14.1
N$4
  Top 0.254: IC4.4 80.64,16.99 81.91,18.26 81.91,29.69 83.18,30.96 83.18,43.03 81.91,44.3 IC5.2
N$5
  Top 0.254: R6.2 70.48,26.52 71.11,25.88 71.11,17.63 JP5.1
N$6  (via drill 0.61)
  Top 0.254: v64.77,27.79 64.77,26.52 65.4,25.88 IC3.11
  Bottom 0.254: v64.77,27.79 64.13,27.79 63.5,28.42 60.96,28.42 60.32,27.79 47.62,27.79 45.72,29.69 40.64,29.69 39.37,28.42 20.95,28.42 20.31,29.06 19.04,29.06 JP2.2
N$7  (via drill 0.61, 0.7)
  Top 0.254: v44.45,76.68 46.35,75.41 IC14.2 46.35,71.6 48.89,69.7 48.89,68.43 46.98,66.52 46.98,61.44 48.26,60.17 48.26,57.63 46.98,56.36 v46.98,55.09 | v118.1,47.47 117.47,48.74 116.2,50.01 113.66,50.01 v112.39,50.65 | v72.38,51.92 v74.29,52.55
  Bottom 0.254: v44.45,76.68 R2.1 | v46.98,55.09 47.62,55.73 52.07,55.73 52.7,55.09 69.21,55.09 v72.38,51.92 | U$2.1 146.25,48.95 144.14,46.84 139.69,46.84 138.42,45.57 135.25,45.57 133.98,44.3 132.71,44.93 131.44,46.2 128.9,46.2 128.27,46.84 128.27,47.47 127.63,48.11 126.99,48.11 123.82,46.2 119.38,46.2 v118.1,47.47 | v112.39,50.65 111.12,50.65 109.85,51.92 106.04,51.92 105.41,51.28 102.86,51.28 101.59,50.01 96.52,50.01 95.88,49.38 95.88,47.47 95.24,46.84 91.44,46.84 90.8,47.47 90.8,50.01 89.53,51.28 79.37,51.28 78.1,52.55 v74.29,52.55
N$8  (via drill 0.7)
  Top 0.254: IC9.7 60.32,5.56 56.51,9.37 56.51,13.18 59.05,15.72 59.05,18.9 v61.59,21.44 | v64.77,21.44 67.3,23.98 67.3,27.15 v66.67,27.79 | v52.7,29.06 52.7,32.23 50.8,34.14 50.8,36.68 49.53,37.95 49.53,39.22 52.7,43.03 52.7,50.01 52.07,50.65 52.07,51.28 52.7,52.55 52.7,57 53.34,57.63 53.34,62.08 51.43,63.98 51.43,64.62 54.61,67.79 54.61,71.6 52.7,73.51 52.7,74.78 53.34,75.41 53.34,76.68 54.61,77.95 54.61,81.13 IC1.22
  Bottom 0.254: v61.59,21.44 v64.77,21.44 | v66.67,27.79 65.4,29.06 v52.7,29.06
N$9  (via drill 1.3)
  other vias: 159.38,77.95
N$10  (via drill 0.61)
  Top 0.254: v43.81,10.01 42.54,11.28 v42.54,13.82 | v33.65,13.82 31.74,13.82 29.84,15.72 29.84,17.63 29.2,18.26 24.76,18.26 24.12,18.9 22.22,18.9 21.58,18.26 20.95,18.26 20.31,17.63 18.41,17.63 18.41,20.8 17.14,22.07 JP3.2
  Bottom 0.254: v43.81,10.01 46.35,10.01 46.35,13.18 47.62,14.45 57.78,14.45 IC3.8 | v33.65,13.82 34.92,13.82 36.19,13.18 37.46,13.82 v42.54,13.82
N$11  (via drill 0.61)
  Top 0.254: v48.26,7.47 51.43,10.64 51.43,13.18 52.07,13.82 54.61,13.82 56.51,15.72 56.51,18.26 57.15,18.9 57.15,20.17 60.32,23.34 IC3.13 | v23.49,8.1 20.95,10.64 20.95,13.82 17.14,17.63 JP4.2
  Bottom 0.254: v48.26,7.47 47.62,6.83 24.76,6.83 v23.49,8.1
N$12
  Top 0.254: IC2.13 27.3,13.18 26.03,14.45 JP6.6
N$13
  Bottom 0.254: IC12.8 71.11,29.06 73.66,29.06 JP14.2
N$14
  Top 0.254: IC2.11 28.57,15.72 JP6.4
N$15  (via drill 1.3)
  other vias: 159.38,67.79
N$16
  Top 0.254: JP12.1 IC5.3
N$17
  Bottom 0.254: IC17.2 113.02,53.19 113.02,55.09 IC7.6
N$18  (via drill 0.61)
  Top 0.254: v75.56,35.41 75.56,65.25 IC8.26
  Bottom 0.254: v75.56,35.41 82.55,35.41 JP20.2
N$19
  Bottom 0.254: IC17.3 116.2,53.82 117.47,52.55 IC7.7
N$20  (via drill 0.61)
  Top 0.254: v120.64,56.36 120.64,51.92 IC7.8
  Bottom 0.254: v120.64,56.36 IC17.4
N$21  (via drill 0.61)